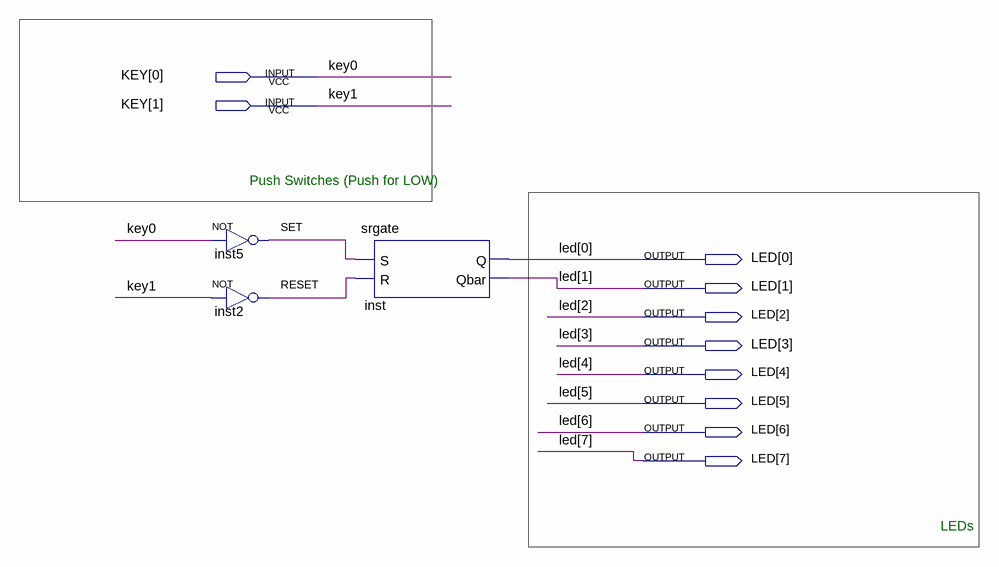
[diagram p0: schematic sheet]
// Quartus schematic TopLevelSchematic.bdf as structural Verilog: 3 symbols, 10 pins
module TopLevelSchematic (
  input  [1:0] KEY,
  output [7:0] LED
);

  wire RESET, SET;

  not inst5 (SET, KEY[0]);
  not inst2 (RESET, KEY[1]);
  srgate inst (.S(SET), .R(RESET), .Q(LED[0]), .Qbar(LED[1]));

  // Notes on the sheet:
  //   Push Switches (Push for LOW)
  //   LEDs
endmodule
